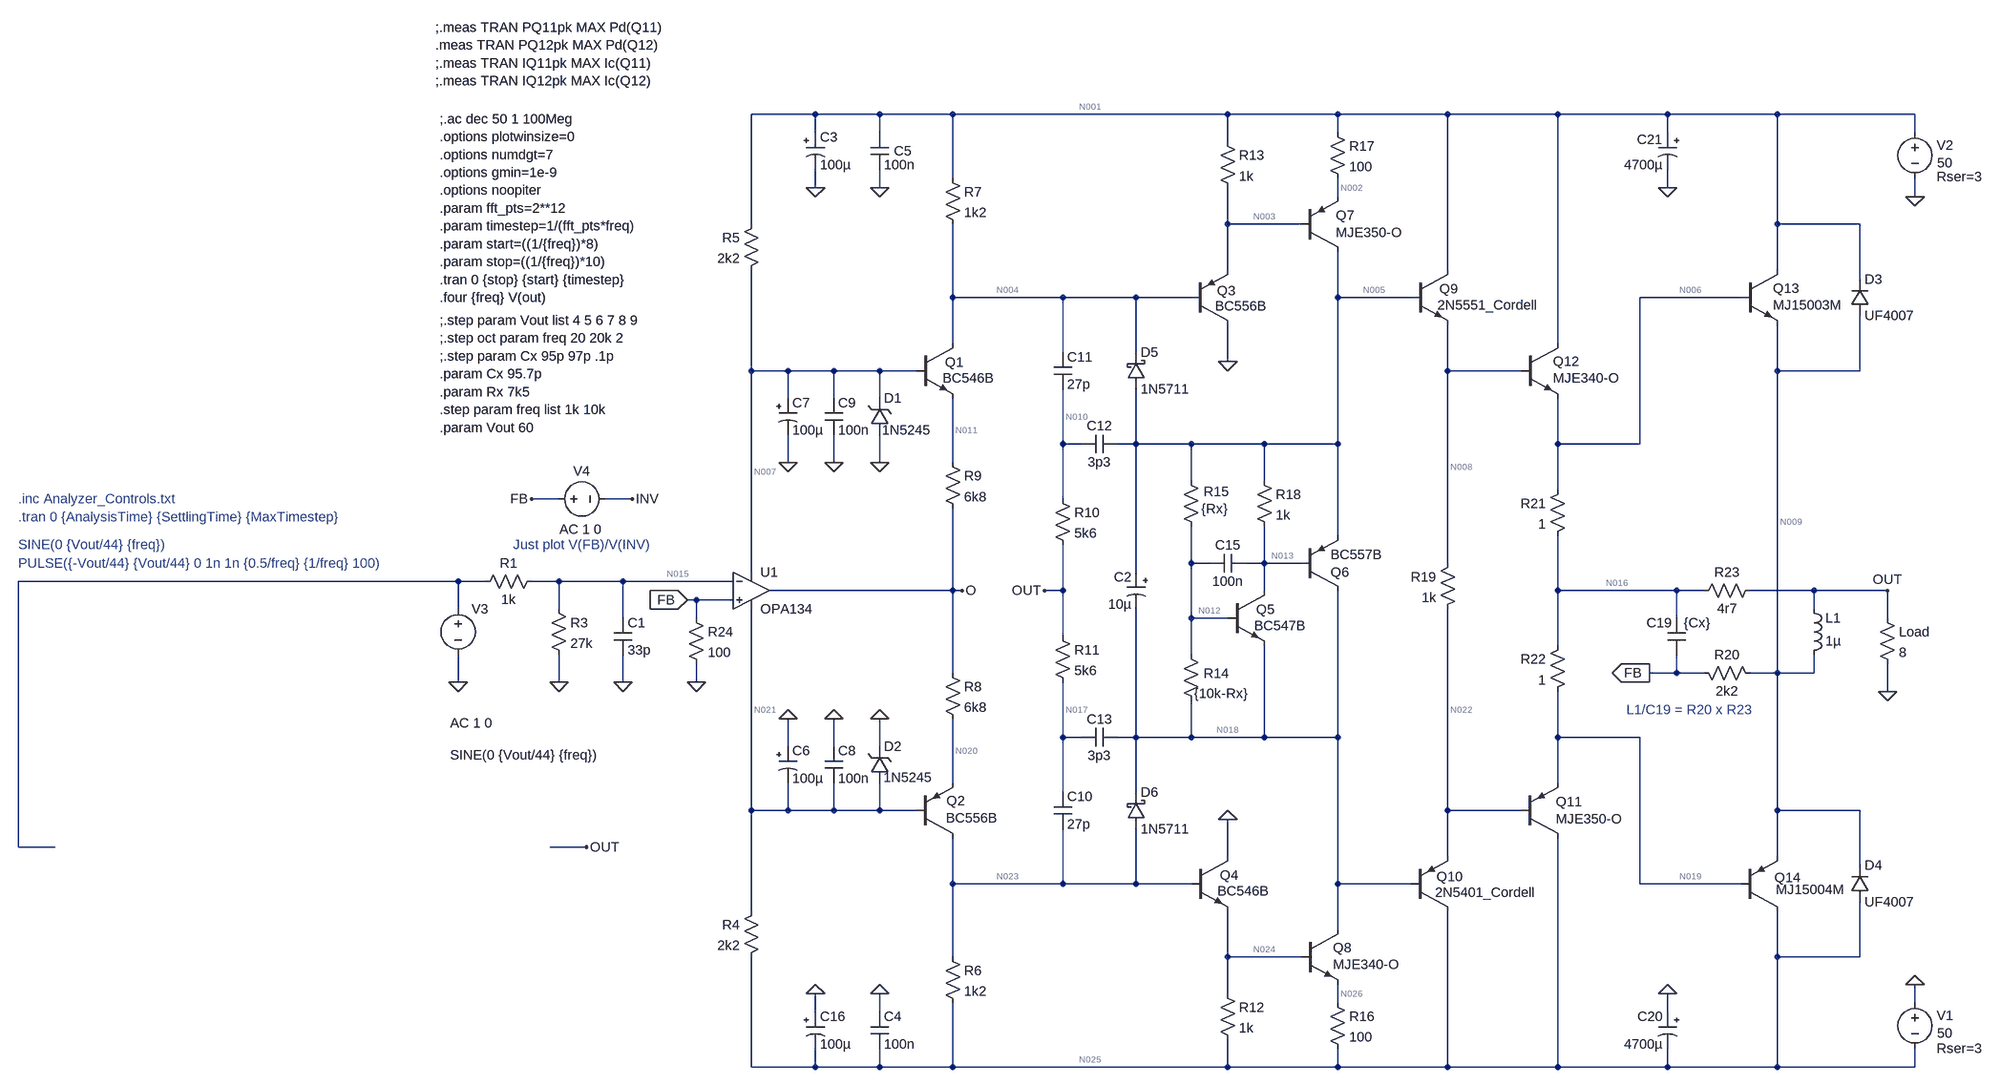
[diagram p0: schematic Current Dumping V1.asc]
Current Dumping V1.asc, the LTspice schematic file:
Version 4
SHEET 1 880 680
WIRE -4016 -2240 -4128 -2240
WIRE -3904 -2240 -4016 -2240
WIRE -3776 -2240 -3904 -2240
WIRE -3296 -2240 -3776 -2240
WIRE -3104 -2240 -3296 -2240
WIRE -2912 -2240 -3104 -2240
WIRE -2720 -2240 -2912 -2240
WIRE -2528 -2240 -2720 -2240
WIRE -2336 -2240 -2528 -2240
WIRE -2096 -2240 -2336 -2240
WIRE -4016 -2208 -4016 -2240
WIRE -3904 -2208 -3904 -2240
WIRE -3104 -2208 -3104 -2240
WIRE -2528 -2208 -2528 -2240
WIRE -2096 -2208 -2096 -2240
WIRE -3296 -2192 -3296 -2240
WIRE -3776 -2128 -3776 -2240
WIRE -4016 -2112 -4016 -2144
WIRE -3904 -2112 -3904 -2144
WIRE -2528 -2112 -2528 -2144
WIRE -3104 -2096 -3104 -2128
WIRE -2096 -2096 -2096 -2128
WIRE -4128 -2048 -4128 -2240
WIRE -3296 -2048 -3296 -2112
WIRE -3168 -2048 -3296 -2048
WIRE -2336 -2048 -2336 -2240
WIRE -2192 -2048 -2336 -2048
WIRE -3296 -1968 -3296 -2048
WIRE -2912 -1968 -2912 -2240
WIRE -2336 -1968 -2336 -2048
WIRE -2192 -1952 -2192 -2048
WIRE -3776 -1920 -3776 -2048
WIRE -3584 -1920 -3776 -1920
WIRE -3456 -1920 -3584 -1920
WIRE -3360 -1920 -3456 -1920
WIRE -3104 -1920 -3104 -2000
WIRE -2976 -1920 -3104 -1920
WIRE -2400 -1920 -2576 -1920
WIRE -3776 -1840 -3776 -1920
WIRE -2720 -1840 -2720 -2240
WIRE -3584 -1824 -3584 -1920
WIRE -3456 -1824 -3456 -1920
WIRE -3296 -1808 -3296 -1872
WIRE -4128 -1792 -4128 -1968
WIRE -4064 -1792 -4128 -1792
WIRE -3984 -1792 -4064 -1792
WIRE -3904 -1792 -3984 -1792
WIRE -3840 -1792 -3904 -1792
WIRE -2912 -1792 -2912 -1872
WIRE -2784 -1792 -2912 -1792
WIRE -2336 -1792 -2336 -1872
WIRE -2192 -1792 -2192 -1888
WIRE -2192 -1792 -2336 -1792
WIRE -4064 -1744 -4064 -1792
WIRE -3984 -1744 -3984 -1792
WIRE -3904 -1744 -3904 -1792
WIRE -3584 -1664 -3584 -1760
WIRE -3552 -1664 -3584 -1664
WIRE -3456 -1664 -3456 -1760
WIRE -3456 -1664 -3488 -1664
WIRE -3360 -1664 -3456 -1664
WIRE -3232 -1664 -3360 -1664
WIRE -3104 -1664 -3104 -1920
WIRE -3104 -1664 -3232 -1664
WIRE -2720 -1664 -2720 -1744
WIRE -2576 -1664 -2576 -1920
WIRE -2576 -1664 -2720 -1664
WIRE -4064 -1632 -4064 -1680
WIRE -3984 -1632 -3984 -1680
WIRE -3904 -1632 -3904 -1680
WIRE -3776 -1632 -3776 -1744
WIRE -3360 -1600 -3360 -1664
WIRE -3232 -1600 -3232 -1664
WIRE -2720 -1584 -2720 -1664
WIRE -4464 -1568 -4512 -1568
WIRE -4336 -1568 -4384 -1568
WIRE -3584 -1568 -3584 -1664
WIRE -3104 -1504 -3104 -1664
WIRE -3360 -1456 -3360 -1520
WIRE -3328 -1456 -3360 -1456
WIRE -3232 -1456 -3232 -1520
WIRE -3232 -1456 -3264 -1456
WIRE -3168 -1456 -3232 -1456
WIRE -2912 -1456 -2912 -1792
WIRE -4128 -1440 -4128 -1792
WIRE -3456 -1440 -3456 -1664
WIRE -4640 -1424 -5408 -1424
WIRE -4592 -1424 -4640 -1424
WIRE -4464 -1424 -4512 -1424
WIRE -4352 -1424 -4464 -1424
WIRE -4160 -1424 -4352 -1424
WIRE -3776 -1408 -3776 -1552
WIRE -3776 -1408 -4096 -1408
WIRE -3760 -1408 -3776 -1408
WIRE -3584 -1408 -3584 -1488
WIRE -3584 -1408 -3616 -1408
WIRE -3232 -1408 -3232 -1456
WIRE -2720 -1408 -2720 -1504
WIRE -2512 -1408 -2720 -1408
WIRE -2464 -1408 -2512 -1408
WIRE -2272 -1408 -2384 -1408
WIRE -2144 -1408 -2272 -1408
WIRE -4224 -1392 -4240 -1392
WIRE -4160 -1392 -4224 -1392
WIRE -4640 -1376 -4640 -1424
WIRE -4464 -1376 -4464 -1424
WIRE -2272 -1376 -2272 -1408
WIRE -4352 -1360 -4352 -1424
WIRE -4224 -1360 -4224 -1392
WIRE -3360 -1360 -3360 -1456
WIRE -3296 -1360 -3360 -1360
WIRE -2512 -1360 -2512 -1408
WIRE -2144 -1360 -2144 -1408
WIRE -3584 -1328 -3584 -1408
WIRE -2720 -1312 -2720 -1408
WIRE -3360 -1296 -3360 -1360
WIRE -3776 -1264 -3776 -1408
WIRE -2512 -1264 -2512 -1296
WIRE -2512 -1264 -2560 -1264
WIRE -2464 -1264 -2512 -1264
WIRE -2336 -1264 -2336 -1792
WIRE -2336 -1264 -2384 -1264
WIRE -2272 -1264 -2272 -1296
WIRE -2272 -1264 -2336 -1264
WIRE -4640 -1248 -4640 -1296
WIRE -4464 -1248 -4464 -1296
WIRE -4352 -1248 -4352 -1296
WIRE -4224 -1248 -4224 -1280
WIRE -2144 -1232 -2144 -1280
WIRE -3584 -1152 -3584 -1248
WIRE -3552 -1152 -3584 -1152
WIRE -3456 -1152 -3456 -1376
WIRE -3456 -1152 -3488 -1152
WIRE -3360 -1152 -3360 -1216
WIRE -3360 -1152 -3456 -1152
WIRE -3232 -1152 -3232 -1312
WIRE -3232 -1152 -3360 -1152
WIRE -3104 -1152 -3104 -1408
WIRE -3104 -1152 -3232 -1152
WIRE -2720 -1152 -2720 -1232
WIRE -2576 -1152 -2720 -1152
WIRE -4064 -1136 -4064 -1184
WIRE -3984 -1136 -3984 -1184
WIRE -3904 -1136 -3904 -1184
WIRE -3776 -1072 -3776 -1184
WIRE -2720 -1072 -2720 -1152
WIRE -3584 -1056 -3584 -1152
WIRE -3456 -1056 -3456 -1152
WIRE -4128 -1024 -4128 -1376
WIRE -4064 -1024 -4064 -1072
WIRE -4064 -1024 -4128 -1024
WIRE -3984 -1024 -3984 -1072
WIRE -3984 -1024 -4064 -1024
WIRE -3904 -1024 -3904 -1072
WIRE -3904 -1024 -3984 -1024
WIRE -3840 -1024 -3904 -1024
WIRE -2912 -1024 -2912 -1376
WIRE -2784 -1024 -2912 -1024
WIRE -2336 -1024 -2336 -1264
WIRE -2192 -1024 -2336 -1024
WIRE -5408 -960 -5408 -1424
WIRE -5344 -960 -5408 -960
WIRE -4416 -960 -4480 -960
WIRE -3296 -944 -3296 -1008
WIRE -2912 -944 -2912 -1024
WIRE -2336 -944 -2336 -1024
WIRE -2192 -928 -2192 -1024
WIRE -3776 -896 -3776 -976
WIRE -3584 -896 -3584 -992
WIRE -3584 -896 -3776 -896
WIRE -3456 -896 -3456 -992
WIRE -3456 -896 -3584 -896
WIRE -3360 -896 -3456 -896
WIRE -3104 -896 -3104 -1152
WIRE -2976 -896 -3104 -896
WIRE -2576 -896 -2576 -1152
WIRE -2400 -896 -2576 -896
WIRE -4128 -848 -4128 -1024
WIRE -3104 -816 -3104 -896
WIRE -3776 -768 -3776 -896
WIRE -3296 -768 -3296 -848
WIRE -3168 -768 -3296 -768
WIRE -2336 -768 -2336 -848
WIRE -2192 -768 -2192 -864
WIRE -2192 -768 -2336 -768
WIRE -3296 -704 -3296 -768
WIRE -3104 -688 -3104 -720
WIRE -2096 -688 -2096 -720
WIRE -4016 -672 -4016 -704
WIRE -3904 -672 -3904 -704
WIRE -2528 -672 -2528 -704
WIRE -4128 -576 -4128 -768
WIRE -4016 -576 -4016 -608
WIRE -4016 -576 -4128 -576
WIRE -3904 -576 -3904 -608
WIRE -3904 -576 -4016 -576
WIRE -3776 -576 -3776 -688
WIRE -3776 -576 -3904 -576
WIRE -3296 -576 -3296 -624
WIRE -3296 -576 -3776 -576
WIRE -3104 -576 -3104 -608
WIRE -3104 -576 -3296 -576
WIRE -2912 -576 -2912 -848
WIRE -2912 -576 -3104 -576
WIRE -2720 -576 -2720 -976
WIRE -2720 -576 -2912 -576
WIRE -2528 -576 -2528 -608
WIRE -2528 -576 -2720 -576
WIRE -2336 -576 -2336 -768
WIRE -2336 -576 -2528 -576
WIRE -2096 -576 -2096 -608
WIRE -2096 -576 -2336 -576
FLAG -4640 -1248 0
FLAG -4464 -1248 0
FLAG -4416 -960 OUT
FLAG -3904 -1632 0
FLAG -3904 -1184 0
FLAG -3904 -2112 0
FLAG -3904 -704 0
FLAG -4064 -1632 0
FLAG -4064 -1184 0
FLAG -2096 -720 0
FLAG -2096 -2096 0
FLAG -2560 -1264 FB
IOPIN -2560 -1264 Out
FLAG -3984 -1184 0
FLAG -3984 -1632 0
FLAG -2144 -1232 0
FLAG -2144 -1408 OUT
FLAG -2528 -2112 0
FLAG -2528 -704 0
FLAG -4352 -1248 0
FLAG -3296 -1808 0
FLAG -3296 -1008 0
FLAG -3760 -1408 O
FLAG -4016 -2112 0
FLAG -4016 -704 0
FLAG -3616 -1408 OUT
FLAG -4240 -1392 FB
IOPIN -4240 -1392 In
FLAG -4512 -1568 FB
FLAG -4336 -1568 INV
FLAG -4224 -1248 0
DATAFLAG -2720 -1936 "Ic(Q12)"
DATAFLAG -2720 -864 "Ic(Q11)"
DATAFLAG -4000 -1408 ""
DATAFLAG -2256 -1408 ""
DATAFLAG -3216 -1664 ""
DATAFLAG -3216 -1152 ""
DATAFLAG -3104 -1776 "I(R17)"
DATAFLAG -3776 -1968 "I(R7)"
DATAFLAG -3296 -2048 "I(R13)"
DATAFLAG -4032 -1792 ""
DATAFLAG -4032 -1024 ""
DATAFLAG -2912 -2048 "Ic(Q9)"
DATAFLAG -4128 -2160 "I(R5)"
DATAFLAG -2480 -1920 ""
DATAFLAG -2480 -896 ""
DATAFLAG -4128 -672 "I(R4)"
DATAFLAG -3776 -848 "I(R6)"
DATAFLAG -3296 -768 "I(R12)"
DATAFLAG -3104 -1040 "I(R16)"
DATAFLAG -2912 -736 "Ic(Q10)"
DATAFLAG -3600 -2240 ""
DATAFLAG -3584 -576 ""
SYMBOL voltage -4640 -1392 R0
WINDOW 123 -14 215 Left 2
WINDOW 39 -14 243 Left 2
WINDOW 3 -14 271 Left 2
SYMATTR Value2 AC 1 0
SYMATTR Value SINE(0 {Vout/44} {freq})
SYMATTR InstName V3
SYMBOL res -4480 -1392 R0
SYMATTR InstName R3
SYMATTR Value 27k
SYMBOL res -3120 -2224 R0
SYMATTR InstName R17
SYMATTR Value 100
SYMBOL res -3120 -704 R0
SYMATTR InstName R16
SYMATTR Value 100
SYMBOL res -4112 -2064 M0
SYMATTR InstName R5
SYMATTR Value 2k2
SYMBOL res -4112 -864 M0
SYMATTR InstName R4
SYMATTR Value 2k2
SYMBOL cap -3920 -2208 R0
WINDOW 0 41 32 Left 2
SYMATTR InstName C5
SYMATTR Value 100n
SYMBOL cap -3920 -672 R0
SYMATTR InstName C4
SYMATTR Value 100n
SYMBOL res -3792 -1648 R0
SYMATTR InstName R9
SYMATTR Value 6k8
SYMBOL res -3792 -1280 R0
SYMATTR InstName R8
SYMATTR Value 6k8
SYMBOL polcap -4080 -1744 R0
SYMATTR InstName C7
SYMATTR Value 100µ
SYMATTR SpiceLine V=63
SYMBOL polcap -4080 -1136 R0
SYMATTR InstName C6
SYMATTR Value 100µ
SYMATTR SpiceLine V=63
SYMBOL voltage -2096 -704 R0
WINDOW 123 0 0 Left 0
WINDOW 39 38 96 Left 2
WINDOW 0 38 38 Left 2
WINDOW 3 39 69 Left 2
SYMATTR SpiceLine Rser=3
SYMATTR InstName V1
SYMATTR Value 50
SYMBOL res -2480 -1392 R270
WINDOW 0 32 56 VTop 2
WINDOW 3 0 56 VBottom 2
SYMATTR InstName R23
SYMATTR Value 4r7
SYMBOL voltage -2096 -2224 R0
WINDOW 123 0 0 Left 0
WINDOW 39 38 93 Left 2
WINDOW 0 38 38 Left 2
WINDOW 3 39 69 Left 2
SYMATTR SpiceLine Rser=3
SYMATTR InstName V2
SYMATTR Value 50
SYMBOL res -2368 -1248 M270
WINDOW 0 32 56 VTop 2
WINDOW 3 0 56 VBottom 2
SYMATTR InstName R20
SYMATTR Value 2k2
SYMBOL ind -2288 -1280 M180
WINDOW 0 36 80 Left 2
WINDOW 3 36 40 Left 2
SYMATTR InstName L1
SYMATTR Value 1µ
SYMATTR SpiceLine Rser=1m
SYMBOL cap -2496 -1296 R180
WINDOW 0 24 56 Left 2
WINDOW 3 -42 56 Left 2
SYMATTR InstName C19
SYMATTR Value {Cx}
SYMBOL pnp -2400 -848 M180
WINDOW 0 59 59 Left 2
WINDOW 3 61 38 Left 2
SYMATTR InstName Q14
SYMATTR Value MJ15004M
SYMBOL npn -2400 -1968 R0
WINDOW 3 56 61 Left 2
SYMATTR Value MJ15003M
SYMATTR InstName Q13
SYMBOL diode -2208 -1888 M180
WINDOW 0 24 64 Left 2
WINDOW 3 24 0 Left 2
SYMATTR InstName D3
SYMATTR Value UF4007
SYMBOL res -3312 -2208 R0
SYMATTR InstName R13
SYMATTR Value 1k
SYMBOL res -3312 -720 R0
SYMATTR InstName R12
SYMATTR Value 1k
SYMBOL cap -4000 -1072 M180
WINDOW 0 24 56 Left 2
WINDOW 3 24 8 Left 2
SYMATTR InstName C8
SYMATTR Value 100n
SYMBOL cap -4000 -1680 M180
WINDOW 0 24 56 Left 2
WINDOW 3 24 8 Left 2
SYMATTR InstName C9
SYMATTR Value 100n
SYMBOL res -2160 -1376 R0
SYMATTR InstName Load
SYMATTR Value 8
SYMBOL zener -3920 -1680 M180
WINDOW 0 24 64 Left 2
WINDOW 3 20 8 Left 2
SYMATTR InstName D1
SYMATTR Value 1N5245
SYMBOL zener -3920 -1072 M180
WINDOW 0 24 64 Left 2
WINDOW 3 23 10 Left 2
SYMATTR InstName D2
SYMATTR Value 1N5245
SYMBOL polcap -2512 -2208 M0
WINDOW 0 25 12 Left 2
SYMATTR InstName C21
SYMATTR Value 4700µ
SYMATTR SpiceLine V=63
SYMBOL polcap -2512 -672 M0
SYMATTR InstName C20
SYMATTR Value 4700µ
SYMATTR SpiceLine V=63
SYMBOL res -2896 -1472 M0
SYMATTR InstName R19
SYMATTR Value 1k
SYMBOL res -3376 -1312 R0
WINDOW 0 38 49 Left 2
WINDOW 3 21 84 Left 2
SYMATTR InstName R14
SYMATTR Value {10k-Rx}
SYMBOL res -3376 -1616 R0
WINDOW 0 38 35 Left 2
WINDOW 3 34 65 Left 2
SYMATTR InstName R15
SYMATTR Value {Rx}
SYMBOL npn -3840 -1840 R0
WINDOW 3 46 61 Left 2
WINDOW 0 50 33 Left 2
SYMATTR Value BC546B
SYMATTR InstName Q1
SYMBOL pnp -3840 -976 M180
WINDOW 0 53 65 Left 2
WINDOW 3 52 35 Left 2
SYMATTR InstName Q2
SYMATTR Value BC556B
SYMBOL npn -3296 -1408 R0
WINDOW 3 46 61 Left 2
WINDOW 0 50 33 Left 2
SYMATTR Value BC547B
SYMATTR InstName Q5
SYMBOL pnp -3168 -1408 M180
WINDOW 0 52 32 Left 2
WINDOW 3 52 63 Left 2
SYMATTR InstName Q6
SYMATTR Value BC557B
SYMBOL res -3248 -1616 R0
SYMATTR InstName R18
SYMATTR Value 1k
SYMBOL res -4496 -1440 R90
WINDOW 0 0 56 VBottom 2
WINDOW 3 32 56 VTop 2
SYMATTR InstName R1
SYMATTR Value 1k
SYMBOL cap -4368 -1296 M180
WINDOW 0 24 56 Left 2
WINDOW 3 24 8 Left 2
SYMATTR InstName C1
SYMATTR Value 33p
SYMBOL npn -3360 -944 R0
WINDOW 3 46 61 Left 2
WINDOW 0 50 33 Left 2
SYMATTR Value BC546B
SYMATTR InstName Q4
SYMBOL pnp -3360 -1872 M180
WINDOW 0 45 60 Left 2
WINDOW 3 42 33 Left 2
SYMATTR InstName Q3
SYMATTR Value BC556B
SYMBOL res -3792 -2144 R0
SYMATTR InstName R7
SYMATTR Value 1k2
SYMBOL res -3792 -784 R0
SYMATTR InstName R6
SYMATTR Value 1k2
SYMBOL cap -3600 -1824 R0
SYMATTR InstName C11
SYMATTR Value 27p
SYMBOL cap -3600 -992 M180
WINDOW 0 24 56 Left 2
WINDOW 3 24 8 Left 2
SYMATTR InstName C10
SYMATTR Value 27p
SYMBOL cap -3328 -1472 M90
WINDOW 0 0 32 VBottom 2
WINDOW 3 32 32 VTop 2
SYMATTR InstName C15
SYMATTR Value 100n
SYMBOL diode -2208 -864 M180
WINDOW 0 24 64 Left 2
WINDOW 3 24 0 Left 2
SYMATTR InstName D4
SYMATTR Value UF4007
SYMBOL res -2704 -1600 M0
SYMATTR InstName R21
SYMATTR Value 1
SYMBOL res -2704 -1328 M0
SYMATTR InstName R22
SYMATTR Value 1
SYMBOL pnp -3168 -2000 M180
WINDOW 0 61 63 Left 2
WINDOW 3 61 33 Left 2
SYMATTR InstName Q7
SYMATTR Value MJE350-O
SYMBOL npn -3168 -816 R0
WINDOW 3 56 61 Left 2
SYMATTR Value MJE340-O
SYMATTR InstName Q8
SYMBOL schottky -3472 -1760 M180
WINDOW 0 24 64 Left 2
WINDOW 3 24 0 Left 2
SYMATTR InstName D5
SYMATTR Value 1N5711
SYMATTR Description Diode
SYMATTR Type diode
SYMBOL schottky -3472 -992 M180
WINDOW 0 24 64 Left 2
WINDOW 3 24 0 Left 2
SYMATTR InstName D6
SYMATTR Value 1N5711
SYMATTR Description Diode
SYMATTR Type diode
SYMBOL polcap -4032 -2208 R0
SYMATTR InstName C3
SYMATTR Value 100µ
SYMATTR SpiceLine V=63
SYMBOL polcap -4032 -672 R0
SYMATTR InstName C16
SYMATTR Value 100µ
SYMATTR SpiceLine V=63
SYMBOL polcap -3440 -1440 M0
SYMATTR InstName C2
SYMATTR Value 10µ
SYMATTR SpiceLine V=63
SYMBOL res -3600 -1584 R0
SYMATTR InstName R10
SYMATTR Value 5k6
SYMBOL res -3600 -1344 R0
SYMATTR InstName R11
SYMATTR Value 5k6
SYMBOL cap -3552 -1680 M90
WINDOW 0 0 32 VBottom 2
WINDOW 3 32 32 VTop 2
SYMATTR InstName C12
SYMATTR Value 3p3
SYMBOL cap -3552 -1168 M90
WINDOW 0 0 32 VBottom 2
WINDOW 3 32 32 VTop 2
SYMATTR InstName C13
SYMATTR Value 3p3
SYMBOL voltage -4480 -1568 R270
WINDOW 123 -53 17 VRight 2
WINDOW 39 -14 243 Left 2
WINDOW 3 -14 271 Left 2
WINDOW 0 49 41 VRight 2
SYMATTR Value2 AC 1 0
SYMATTR Value ""
SYMATTR InstName V4
SYMBOL res -4240 -1376 R0
SYMATTR InstName R24
SYMATTR Value 100
SYMBOL AmpOps\\OPA134 -4128 -1472 R0
SYMATTR InstName U1
SYMBOL npn -2976 -1968 R0
WINDOW 3 46 61 Left 2
WINDOW 0 50 33 Left 2
SYMATTR Value 2N5551_Cordell
SYMATTR InstName Q9
SYMBOL pnp -2976 -848 M180
WINDOW 0 45 60 Left 2
WINDOW 3 42 33 Left 2
SYMATTR InstName Q10
SYMATTR Value 2N5401_Cordell
SYMBOL pnp -2784 -976 M180
WINDOW 0 61 63 Left 2
WINDOW 3 61 33 Left 2
SYMATTR InstName Q11
SYMATTR Value MJE350-O
SYMBOL npn -2784 -1840 R0
WINDOW 3 56 61 Left 2
SYMATTR Value MJE340-O
SYMATTR InstName Q12
TEXT -4672 -1880 Left 2 !;.step param Vout list 4 5 6 7 8 9\n;.step oct param freq 20 20k 2\n;.step param Cx 95p 97p .1p\n.param Cx 95.7p\n.param Rx 7k5\n.step param freq list 1k 10k\n.param Vout 60
TEXT -5408 -1568 Left 2 ;.inc Analyzer_Controls.txt\n.tran 0 {AnalysisTime} {SettlingTime} {MaxTimestep}
TEXT -4672 -2232 Left 2 !;.ac dec 50 1 100Meg\n.options plotwinsize=0\n.options numdgt=7\n.options gmin=1e-9\n.options noopiter\n.param fft_pts=2**12\n.param timestep=1/(fft_pts*freq)\n.param start=((1/{freq})*8)\n.param stop=((1/{freq})*10)\n.tran 0 {stop} {start} {timestep}\n.four {freq} V(out)
TEXT -5408 -1456 Left 2 ;PULSE({-Vout/44} {Vout/44} 0 1n 1n {0.5/freq} {1/freq} 100)
TEXT -4544 -1488 Left 2 ;Just plot V(FB)/V(INV)
TEXT -5408 -1488 Left 2 ;SINE(0 {Vout/44} {freq})
TEXT -2600 -1200 Left 2 ;L1/C19 = R20 x R23
TEXT -4680 -2392 Left 2 !;.meas TRAN PQ11pk MAX Pd(Q11)\n.meas TRAN PQ12pk MAX Pd(Q12)\n;.meas TRAN IQ11pk MAX Ic(Q11)\n;.meas TRAN IQ12pk MAX Ic(Q12)

The netlist it stands for:
* Current Dumping V1.asc
V3 N014 0 SINE(0 {Vout/44} {freq}) AC 1 0
R3 N015 0 27k
R17 N001 N002 100
R16 N026 N025 100
R5 N001 N007 2k2
R4 N021 N025 2k2
C5 N001 0 100n
C4 0 N025 100n
R9 N011 O 6k8
R8 O N020 6k8
C7 N007 0 100µ V=63
C6 0 N021 100µ V=63
V1 0 N025 50 Rser=3
R23 N016 OUT 4r7
V2 N001 0 50 Rser=3
R20 N009 FB 2k2
L1 N009 OUT 1µ Rser=1m
C19 FB N016 {Cx}
Q14 N025 N019 N009 0 MJ15004M
Q13 N001 N006 N009 0 MJ15003M
D3 N009 N001 UF4007
R13 N001 N003 1k
R12 N024 N025 1k
C8 N021 0 100n
C9 0 N007 100n
R§Load OUT 0 8
D1 0 N007 1N5245
D2 N021 0 1N5245
C21 N001 0 4700µ V=63
C20 0 N025 4700µ V=63
R19 N008 N022 1k
R14 N012 N018 {10k-Rx}
R15 N005 N012 {Rx}
Q1 N004 N007 N011 0 BC546B
Q2 N023 N021 N020 0 BC556B
Q5 N013 N012 N018 0 BC547B
Q6 N018 N013 N005 0 BC557B
R18 N005 N013 1k
R1 N015 N014 1k
C1 0 N015 33p
Q4 0 N023 N024 0 BC546B
Q3 0 N004 N003 0 BC556B
R7 N001 N004 1k2
R6 N023 N025 1k2
C11 N004 N010 27p
C10 N023 N017 27p
C15 N012 N013 100n
D4 N025 N009 UF4007
R21 N006 N016 1
R22 N016 N019 1
Q7 N005 N003 N002 0 MJE350-O
Q8 N018 N024 N026 0 MJE340-O
D5 N005 N004 1N5711
D6 N023 N018 1N5711
C3 N001 0 100µ V=63
C16 0 N025 100µ V=63
C2 N005 N018 10µ V=63
R10 N010 OUT 5k6
R11 OUT N017 5k6
C12 N010 N005 3p3
C13 N017 N018 3p3
V4 FB INV AC 1 0
R24 FB 0 100
* U1: OPA134 (symbol AmpOps\OPA134 not available, pins judged from their places): In+=FB In-=N015 V+=N007 V-=N021 OUT=O
Q9 N001 N005 N008 0 2N5551_Cordell
Q10 N025 N018 N022 0 2N5401_Cordell
Q11 N025 N022 N019 0 MJE350-O
Q12 N001 N008 N006 0 MJE340-O
.model D D
.lib standard.dio
.model NPN NPN
.model PNP PNP
.lib standard.bjt
;.step param Vout list 4 5 6 7 8 9
;.step oct param freq 20 20k 2
;.step param Cx 95p 97p .1p
.param Cx 95.7p
.param Rx 7k5
.step param freq list 1k 10k
.param Vout 60
* .inc Analyzer_Controls.txt
* .tran 0 {AnalysisTime} {SettlingTime} {MaxTimestep}
;.ac dec 50 1 100Meg
.options plotwinsize=0
.options numdgt=7
.options gmin=1e-9
.options noopiter
.param fft_pts=2**12
.param timestep=1/(fft_pts*freq)
.param start=((1/{freq})*8)
.param stop=((1/{freq})*10)
.tran 0 {stop} {start} {timestep}
.four {freq} V(out)
* PULSE({-Vout/44} {Vout/44} 0 1n 1n {0.5/freq} {1/freq} 100)
* Just plot V(FB)/V(INV)
* SINE(0 {Vout/44} {freq})
* L1/C19 = R20 x R23
;.meas TRAN PQ11pk MAX Pd(Q11)
.meas TRAN PQ12pk MAX Pd(Q12)
;.meas TRAN IQ11pk MAX Ic(Q11)
;.meas TRAN IQ12pk MAX Ic(Q12)
.backanno
.end

* Results of the author's LTspice run, read from the files saved beside the schematic
* Operating Point (first step), zero values left out:
*   freq = 1 k
*   V(n015) = -14.98 µV
*   V(n001) = 49.87 V
*   V(n002) = 48.6 V
*   V(n026) = -48.59 V
*   V(n025) = -49.87 V
*   V(n007) = 15.02 V
*   V(n021) = -15.02 V
*   V(n011) = 14.37 V
*   V(o) = -45.67 mV
*   V(n020) = -14.4 V
*   V(n016) = -666.9 µV
*   V(out) = -419.6 µV
*   V(n009) = -419.6 µV
*   V(fb) = -19.73 µV
*   V(n019) = -9.431 mV
*   V(n006) = 8.045 mV
*   V(n003) = 47.95 V
*   V(n024) = -47.99 V
*   V(n008) = 598.1 mV
*   V(n022) = -644.9 mV
*   V(n012) = -647.3 mV
*   V(n018) = -1.278 V
*   V(n005) = 1.263 V
*   V(n004) = 47.34 V
*   V(n023) = -47.35 V
*   V(n013) = 564.1 mV
*   V(n010) = -419.6 µV
*   V(n017) = -419.6 µV
*   V(inv) = -19.73 µV
*   Ic(Q10) = -1.282 mA
*   Ib(Q10) = -4.72 µA
*   Ie(Q10) = 1.286 mA
*   Ic(Q9) = 1.314 mA
*   Ib(Q9) = 10.25 µA
*   Ie(Q9) = -1.324 mA
*   Ic(Q12) = 8.631 mA
*   Ib(Q12) = 81.05 µA
*   Ie(Q12) = -8.712 mA
*   Ic(Q8) = 12.7 mA
*   Ib(Q8) = 113.1 µA
*   Ie(Q8) = -12.81 mA
*   Ic(Q11) = -8.721 mA
*   Ib(Q11) = -43.32 µA
*   Ie(Q11) = 8.765 mA
*   Ic(Q7) = -12.7 mA
*   Ib(Q7) = -60.97 µA
*   Ie(Q7) = 12.76 mA
*   Ic(Q6) = -11.7 mA
*   Ib(Q6) = -36.73 µA
*   Ie(Q6) = 11.74 mA
*   Ic(Q5) = 735.2 µA
*   Ib(Q5) = 2.55 µA
*   Ie(Q5) = -737.8 µA
*   Ic(Q3) = -1.981 mA
*   Ib(Q3) = -1.818 µA
*   Ie(Q3) = 1.983 mA
*   Ic(Q2) = -2.108 mA
*   Ib(Q2) = -2.512 µA
*   Ie(Q2) = 2.111 mA
*   Ic(Q4) = 1.992 mA
*   Ib(Q4) = 3.946 µA
*   Ie(Q4) = -1.996 mA
*   Ic(Q1) = 2.115 mA
*   Ib(Q1) = 4.895 µA
*   Ie(Q1) = -2.12 mA
*   Ic(Q13) = 49.91 nA
*   Ib(Q13) = -49.31 nA
*   Ie(Q13) = -598.2 pA
*   Ic(Q14) = -49.91 nA
*   Ib(Q14) = 49.38 nA
*   Ie(Q14) = 530 pA
*   I(D6) = -65.77 nA
*   I(D5) = -65.77 nA
*   I(D2) = -11.67 mA
*   I(D1) = -11.67 mA
*   I(D4) = -3.338 µA
*   I(D3) = -3.338 µA
*   I(L1) = 181.8 nA
*   I(R24) = -197.3 nA
*   I(R22) = 8.765 mA
*   I(R21) = 8.712 mA
*   I(R6) = 2.104 mA
*   I(R7) = 2.114 mA
*   I(R1) = -14.98 nA
*   I(R18) = 698.5 µA
*   I(R15) = 254.6 µA
*   I(R14) = 252.1 µA
*   I(R19) = 1.243 mA
*   I(Load) = -52.45 µA
*   I(R12) = 1.883 mA
*   I(R13) = 1.922 mA
*   I(R20) = -181.7 nA
*   I(R23) = -52.63 µA
*   I(R8) = 2.111 mA
*   I(R9) = 2.12 mA
*   I(R4) = 15.84 mA
*   I(R5) = 15.84 mA
*   I(R16) = 12.81 mA
*   I(R17) = 12.76 mA
*   I(R3) = -554.9 pA
*   I(V2) = -42.59 mA
*   I(V1) = -42.64 mA
*   I(V3) = -14.98 nA
*   Ix(u1:1) = 15.54 nA
*   Ix(u1:2) = 15.54 nA
*   Ix(u1:3) = 4.165 mA
*   Ix(u1:4) = -4.166 mA
*   Ix(u1:5) = 9.642 µA
* From the log:
*   N-Period=1
*   Fourier components of V(out)
*   DC component:-0.000419525
*   Harmonic  Frequency   Fourier   Normalized   Phase    Normalized
*    Number     [Hz]     Component   Component  [degree]  Phase [deg]
*       1     1.000e+03  3.024e+01  1.000e+00     -0.13°      0.00°
*       2     2.000e+03  3.347e-06  1.107e-07   -170.40°   -170.27°
*       3     3.000e+03  5.440e-05  1.799e-06     31.70°     31.83°
*       4     4.000e+03  5.345e-07  1.767e-08     -2.98°     -2.85°
*       5     5.000e+03  2.731e-05  9.030e-07     -8.10°     -7.97°
*       6     6.000e+03  1.033e-06  3.415e-08   -174.44°   -174.32°
*       7     7.000e+03  1.924e-05  6.363e-07     -1.76°     -1.63°
*       8     8.000e+03  7.642e-07  2.527e-08   -172.18°   -172.05°
*       9     9.000e+03  1.505e-05  4.976e-07     -3.84°     -3.71°
*   Total Harmonic Distortion: 0.000217%(0.000000%)
*   N-Period=1
*   Fourier components of V(out)
*   DC component:-0.00040772
*   Harmonic  Frequency   Fourier   Normalized   Phase    Normalized
*    Number     [Hz]     Component   Component  [degree]  Phase [deg]
*       1     1.000e+04  3.024e+01  1.000e+00     -1.29°      0.00°
*       2     2.000e+04  6.258e-05  2.069e-06   -121.34°   -120.05°
*       3     3.000e+04  2.604e-04  8.611e-06     82.50°     83.79°
*       4     4.000e+04  7.084e-06  2.343e-07    -88.28°    -86.98°
*       5     5.000e+04  8.468e-05  2.800e-06    -29.12°    -27.82°
*       6     6.000e+04  1.951e-05  6.452e-07   -134.96°   -133.67°
*       7     7.000e+04  8.102e-05  2.679e-06    -14.08°    -12.78°
*       8     8.000e+04  1.721e-05  5.691e-07   -135.86°   -134.56°
*       9     9.000e+04  9.847e-05  3.256e-06    -19.47°    -18.18°
*   Total Harmonic Distortion: 0.001024%(0.008607%)
*   Measurement "pq12pk" FAIL'ed